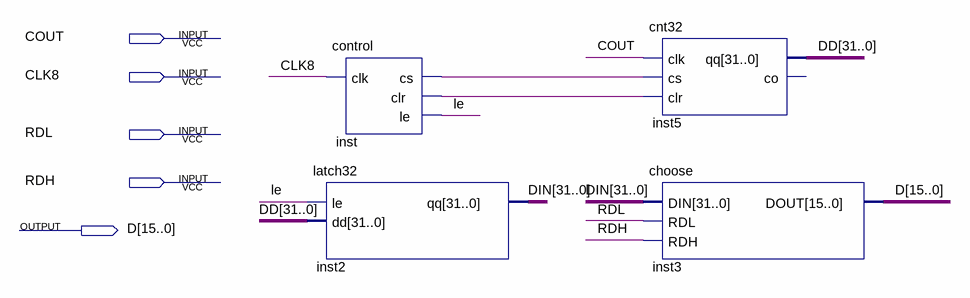
[diagram p0: schematic sheet]
// Quartus schematic freqcalc.bdf as structural Verilog: 4 symbols, 5 pins
module freqcalc (
  input  COUT,
  input  CLK8,
  input  RDL,
  input  RDH,
  output [15:0] D
);

  wire inst_clr, inst_cs, le;
  wire [31:0] DD, DIN;

  control inst (.clk(CLK8), .cs(inst_cs), .clr(inst_clr), .le(le));
  latch32 inst2 (.le(le), .dd(DD), .qq(DIN));
  cnt32 inst5 (.clk(COUT), .cs(inst_cs), .clr(inst_clr), .qq(DD));  // open: co
  choose inst3 (.DIN(DIN), .RDL(RDL), .RDH(RDH), .DOUT(D));
endmodule
